# Altium schematic sheet Upstream_Port.SchDoc: Upstream Port
size 431 x 279 mm; Author: Eric Liu; SheetNumber: 5; SheetTotal: 6
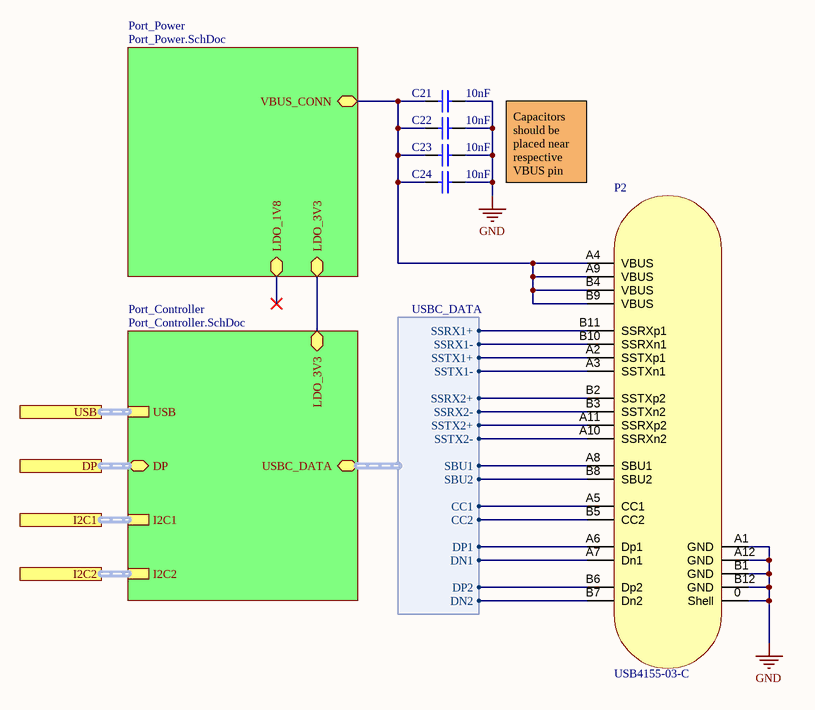
[diagram p0: Upstream_Port.SchDoc]

## Parts
C21  value 10nF  [CAP0402]  (hidden comment: CC0402KRX7R9BB103)
C22  value 10nF  [CAP0402]  (hidden comment: CC0402KRX7R9BB103)
C23  value 10nF  [CAP0402]  (hidden comment: CC0402KRX7R9BB103)
C24  value 10nF  [CAP0402]  (hidden comment: CC0402KRX7R9BB103)
P2  USB4155-03-C  [USB4155-03-C]

## Sub-sheets
Port_Controller = Port_Controller.SchDoc: USB (harness USB), I2C1 (harness USB), DP (bidir, harness DP), USBC_DATA (bidir, harness USBC_DATA), LDO_3V3 (bidir), I2C2 (harness USB)
Port_Power = Port_Power.SchDoc: LDO_3V3 (bidir), LDO_1V8 (bidir), VBUS_CONN (bidir)

## Ports
DP, I2C1, I2C2, USB

## Harnesses
USBC_DATA: SSRX1+, SSRX1-, SSTX1+, SSTX1-, SSRX2+, SSRX2-, SSTX2+, SSTX2-, CC1, CC2, SBU1, SBU2, DP1, DN1, DP2, DN2

## Nets
GND: C21.1 C22.1 C23.1 C24.1 P2.0(Shell) P2.A1(GND) P2.A12(GND) P2.B1(GND) P2.B12(GND)
NetC21_2: C21.2 C22.2 C23.2 C24.2 P2.A4(VBUS) P2.A9(VBUS) P2.B4(VBUS) P2.B9(VBUS) ; sheet Port_Power/VBUS_CONN
NetP2_A2: P2.A2(SSTXp1) ; sheet Port_Controller/USBC_DATA.SSTX1+
NetP2_A3: P2.A3(SSTXn1) ; sheet Port_Controller/USBC_DATA.SSTX1-
NetP2_A5: P2.A5(CC1) ; sheet Port_Controller/USBC_DATA.CC1
NetP2_A6: P2.A6(Dp1) ; sheet Port_Controller/USBC_DATA.DP1
NetP2_A7: P2.A7(Dn1) ; sheet Port_Controller/USBC_DATA.DN1
NetP2_A8: P2.A8(SBU1) ; sheet Port_Controller/USBC_DATA.SBU1
NetP2_A10: P2.A10(SSRXn2) ; sheet Port_Controller/USBC_DATA.SSTX2-
NetP2_A11: P2.A11(SSRXp2) ; sheet Port_Controller/USBC_DATA.SSTX2+
NetP2_B2: P2.B2(SSTXp2) ; sheet Port_Controller/USBC_DATA.SSRX2+
NetP2_B3: P2.B3(SSTXn2) ; sheet Port_Controller/USBC_DATA.SSRX2-
NetP2_B5: P2.B5(CC2) ; sheet Port_Controller/USBC_DATA.CC2
NetP2_B6: P2.B6(Dp2) ; sheet Port_Controller/USBC_DATA.DP2
NetP2_B7: P2.B7(Dn2) ; sheet Port_Controller/USBC_DATA.DN2
NetP2_B8: P2.B8(SBU2) ; sheet Port_Controller/USBC_DATA.SBU2
NetP2_B10: P2.B10(SSRXn1) ; sheet Port_Controller/USBC_DATA.SSRX1-
NetP2_B11: P2.B11(SSRXp1) ; sheet Port_Controller/USBC_DATA.SSRX1+
(unnamed): sheet Port_Controller/LDO_3V3, sheet Port_Power/LDO_3V3

## Buses and harness runs
harness port DP = sheet Port_Controller/DP
harness port I2C1 = sheet Port_Controller/I2C1
harness port I2C2 = sheet Port_Controller/I2C2
harness port USB = sheet Port_Controller/USB

## Notes on the sheet
- Capacitors should be placed near respective VBUS pin
- DWG. NO.
- REV.
- SHT.
- THIS DOCUMENT AND THE DATA DISCLOSED HEREIN OR HEREWITH IS THE PROPERTY OF ALTIUM LIMITED AND MAY BE FREELY DISTRIBUTED IN WHOLE. NO RIGHTS ARE RESERVED OR EXPRESS OR IMPLIED WARANTEE GIVEN.
- REVISION
- DESCRIPTION
- DATE
- APPROVED
- ENG:
- APPROVALS
- PROJECT
- DSN:
- CHK:
- REFERENCE DOCUMENTS
- PROJECT REVISION:
- TITLE
- DOCUMENT REVISION:
- DESIGN ITEM:
- BOM:
- FAB DWG:
- PCB DWG:
- ASSY DWG:
- SCALE:
- SIZE
- B
- CAGE CODE
- FILE NAME
- DWG NO.
- SHEET
- OF
- REV

## Library data of the parts
C21-C24 = CC0402KRX7R9BB103: 10000 pF ±10% 50V Ceramic Capacitor X7R 0402 (1005 Metric); Temperature Coefficient: X7R; Package: 0402 (1005 Metric); Voltage: 50V
P2 = USB4155-03-C: USB-C (USB TYPE-C) USB 3.2 Gen 2 (USB 3.1 Gen 2, Superspeed + (USB 3.1)) Plug Connector 24 Position Board Edge, Surface Mount; Through Hole, Right Angle; Manufacturer: GCT; Manufacturer Product Number: USB4056-03-A; Voltage: 48VDC; Supplier: DigiKey; Supplier Part Number: 2073-USB4056-03-ACT-ND; Datasheet: https://gct.co/connector/usb4056; Standards: USB 3.2 Gen 2; Operating Temperature: -25°C ~ 85°C